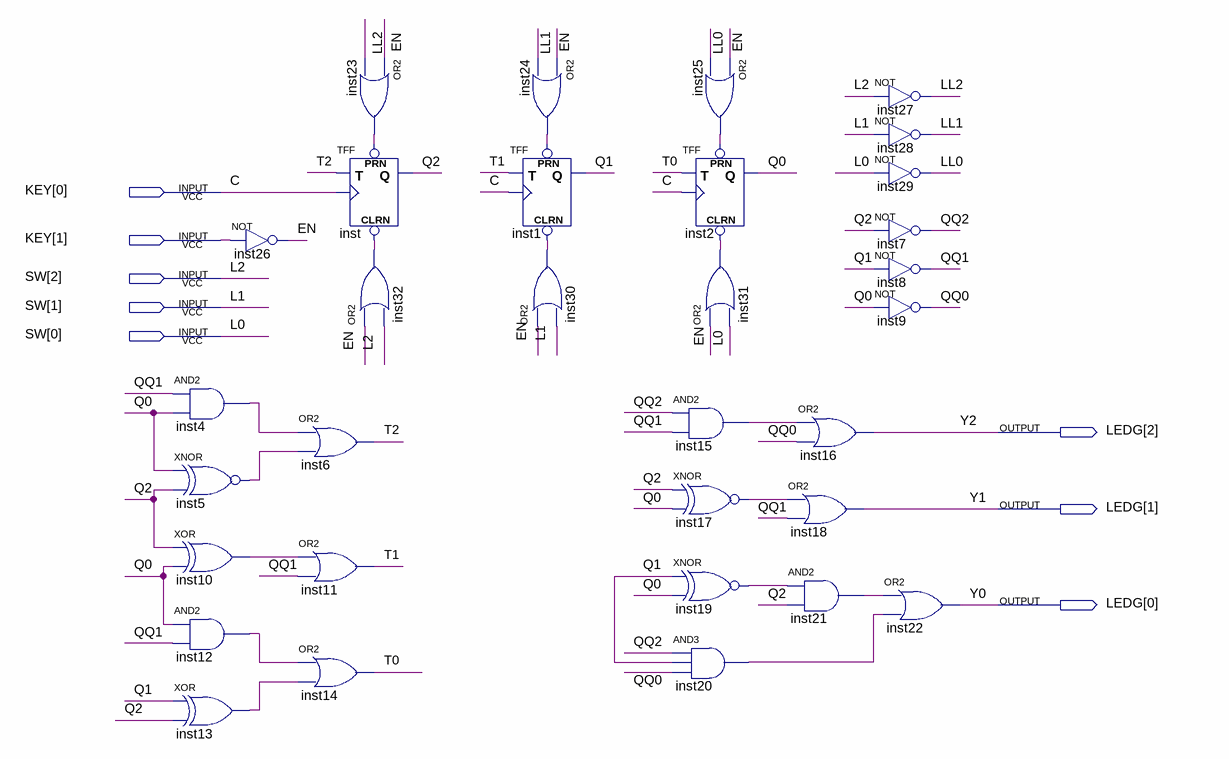
[diagram p0: schematic sheet]
// Quartus schematic Lab01.bdf as structural Verilog: 32 symbols, 8 pins
module Lab01 (
  input  [1:0] KEY,
  input  [2:0] SW,
  output [2:0] LEDG
);

  wire EN, inst4_out, inst5_out, inst10_out, inst12_out, inst13_out, inst15_out, inst17_out, inst19_out,
       inst20_out, inst21_out, inst23_out, inst24_out, inst25_out, inst30_out, inst31_out, inst32_out, LL0,
       LL1, LL2, Q0, Q1, Q2, QQ0, QQ1, QQ2, T0, T1, T2;

  and inst4 (inst4_out, QQ1, Q0);
  xnor inst5 (inst5_out, Q0, Q2);
  xor inst10 (inst10_out, Q2, Q0);
  and inst12 (inst12_out, Q0, QQ1);
  xor inst13 (inst13_out, Q1, Q2);
  not inst26 (EN, KEY[1]);
  TFF inst (.PRN(inst23_out), .CLRN(inst32_out), .T(T2), .CLK(KEY[0]), .Q(Q2));
  or inst6 (T2, inst4_out, inst5_out);
  or inst11 (T1, inst10_out, QQ1);
  or inst14 (T0, inst12_out, inst13_out);
  or inst23 (inst23_out, EN, LL2);
  or inst32 (inst32_out, EN, SW[2]);
  or inst24 (inst24_out, EN, LL1);
  TFF inst1 (.PRN(inst24_out), .CLRN(inst30_out), .T(T1), .CLK(KEY[0]), .Q(Q1));
  or inst30 (inst30_out, EN, SW[1]);
  or inst25 (inst25_out, EN, LL0);
  TFF inst2 (.PRN(inst25_out), .CLRN(inst31_out), .T(T0), .CLK(KEY[0]), .Q(Q0));
  or inst31 (inst31_out, EN, SW[0]);
  and inst15 (inst15_out, QQ2, QQ1);
  xnor inst17 (inst17_out, Q2, Q0);
  xnor inst19 (inst19_out, Q1, Q0);
  and inst20 (inst20_out, QQ2, Q1, QQ0);
  or inst16 (LEDG[2], inst15_out, QQ0);
  or inst18 (LEDG[1], inst17_out, QQ1);
  and inst21 (inst21_out, inst19_out, Q2);
  not inst27 (LL2, SW[2]);
  not inst28 (LL1, SW[1]);
  not inst29 (LL0, SW[0]);
  not inst7 (QQ2, Q2);
  not inst8 (QQ1, Q1);
  not inst9 (QQ0, Q0);
  or inst22 (LEDG[0], inst21_out, inst20_out);

  // Other names for the same wires on the sheet: C = KEY[0]; L0 = SW[0]; L1 = SW[1]; L2 = SW[2]; Y0 = LEDG[0];
  //   Y1 = LEDG[1]; Y2 = LEDG[2]
endmodule
